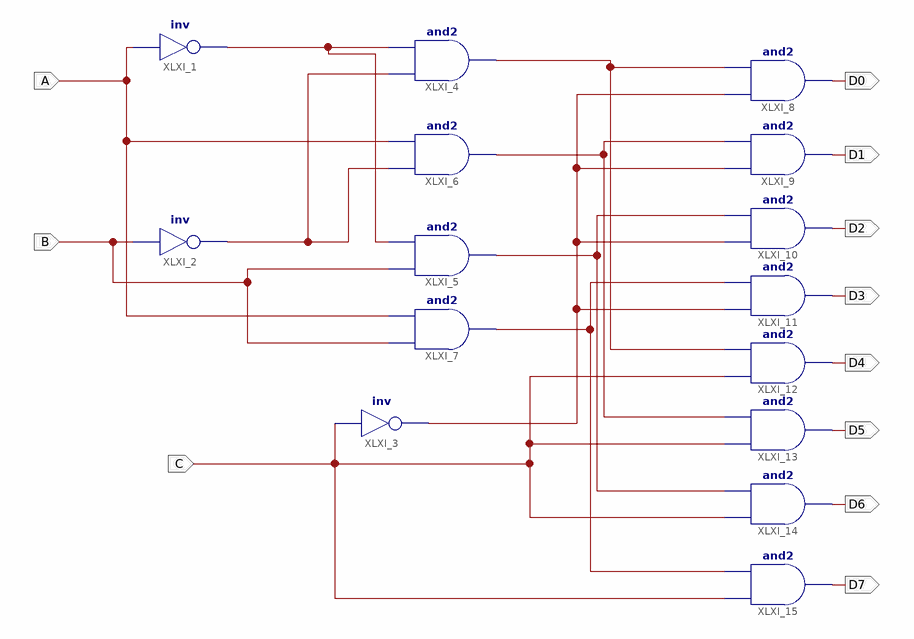
[diagram p0: schematic sheet 1]
// Xilinx ISE schematic decorder38.sch (spartan3) as structural Verilog: 15 symbols, 11 ports
module decorder38 (
  input  A,
  input  B,
  input  C,
  output D0,
  output D1,
  output D2,
  output D3,
  output D4,
  output D5,
  output D6,
  output D7
);

  wire XLXN_1, XLXN_2, XLXN_13, XLXN_15, XLXN_17, XLXN_19, XLXN_28;

  not XLXI_1 (XLXN_1, A);
  not XLXI_2 (XLXN_2, B);
  not XLXI_3 (XLXN_28, C);
  and XLXI_4 (XLXN_13, XLXN_2, XLXN_1);
  and XLXI_5 (XLXN_17, B, XLXN_1);
  and XLXI_6 (XLXN_15, XLXN_2, A);
  and XLXI_7 (XLXN_19, B, A);
  and XLXI_8 (D0, XLXN_28, XLXN_13);
  and XLXI_9 (D1, XLXN_28, XLXN_15);
  and XLXI_10 (D2, XLXN_28, XLXN_17);
  and XLXI_11 (D3, XLXN_28, XLXN_19);
  and XLXI_12 (D4, C, XLXN_13);
  and XLXI_13 (D5, C, XLXN_15);
  and XLXI_14 (D6, C, XLXN_17);
  and XLXI_15 (D7, C, XLXN_19);
endmodule
